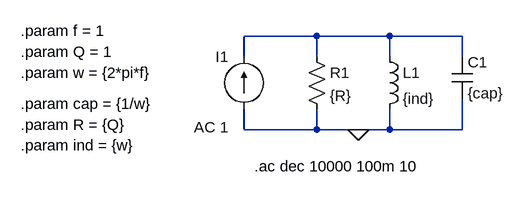
[diagram p0: schematic Circuito RLC.asc]
Circuito RLC.asc, the LTspice schematic file:
Version 4
SHEET 1 880 680
WIRE 208 80 96 80
WIRE 320 80 208 80
WIRE 432 80 320 80
WIRE 96 112 96 80
WIRE 208 112 208 80
WIRE 320 112 320 80
WIRE 432 112 432 80
WIRE 96 224 96 192
WIRE 208 224 208 192
WIRE 208 224 96 224
WIRE 272 224 208 224
WIRE 320 224 320 192
WIRE 320 224 272 224
WIRE 432 224 432 176
WIRE 432 224 320 224
FLAG 272 224 0
SYMBOL current 96 192 R180
WINDOW 0 24 80 Left 2
WINDOW 3 24 0 Left 2
WINDOW 123 24 -28 Left 2
WINDOW 39 0 0 Left 0
SYMATTR InstName I1
SYMATTR Value ""
SYMATTR Value2 AC 1
SYMBOL res 192 96 R0
SYMATTR InstName R1
SYMATTR Value {R}
SYMBOL ind 304 96 R0
SYMATTR InstName L1
SYMATTR Value {ind}
SYMBOL cap 416 112 R0
SYMATTR InstName C1
SYMATTR Value {cap}
TEXT -248 72 Left 2 !.param f = 1
TEXT -248 104 Left 2 !.param Q = 1
TEXT -248 136 Left 2 !.param w = {2*pi*f}
TEXT -248 184 Left 2 !.param cap = {1/w}
TEXT -248 216 Left 2 !.param R = {Q}
TEXT 112 280 Left 2 !.ac dec 10000 100m 10
TEXT -248 248 Left 2 !.param ind = {w}

The netlist it stands for:
* Circuito RLC.asc
I1 0 N001 AC 1
R1 N001 0 {R}
L1 N001 0 {ind}
C1 N001 0 {cap}
.param f = 1
.param Q = 1
.param w = {2*pi*f}
.param cap = {1/w}
.param R = {Q}
.ac dec 10000 100m 10
.param ind = {w}
.backanno
.end